# Altium schematic sheet BoardA.SchDoc
size C; SheetNumber: 1; SheetTotal: 2; SPICEModelCacheRKNZGAWU: <root> / <DocumentId>RKNZGAWU</DocumentId> / <CacheFrame Number="0"> / <Model Name="umk107bj105_a-t" Kind="CKT"> / <Text>* UMK107BJ105_A-T     SPICE MODEL  ( General Type ) / *-------------------------------------------------------------------------------------------------------- / * Model Generated by TAIYO YUDEN Corporation (http://www.ty-top.com) / * Version 1.0 / * TAIYO YUDEN Control No. 170508_130520 / * Copyright(c) 2012 TAIYO YUDEN CO.,LTD. All Rights Reserved. / *-------------------------------------------------------------------------------------------------------- / * / * Products Name : Multilayer Ceramic Capacitors / * / * Characteristics : / *     Capacitance : 1 uF , Rated Voltage : 50V , TCC : X5R / *     Case Size : 1.6 x 0.8 / 0.063 x 0.031 [mm/inch] , Thickness : 0.8 / 0.031 [mm/inch] / *     (Conditions: Temperature = 25 degC , DC Bias Current/Voltage = 0A / 0V) / * / * Frequency Range : 40Hz - 3GHz / * / * External Node Assignments : / * / *  1  o---| |---o  2 / * / *-------------------------------------------------------------------------------------------------------- / .SubCkt UMK107BJ105_A-T 1 2 / **************************** / C0 1 110 0.79929u / Cm 1 101 0.13681u / C1 101 102 0.26224u / Rc1 101 102 5.8806k / C2 102 103 0.057839u / Rc2 102 103 469.42 / C3 103 110 0.014568u / Rc3 103 110 14.853 / C2m 1 301 0.13283u / C21 301 302 1.2593u / Rc21 301 302 6.3079k / C22 302 303 1.1189u / Rc22 302 303 6.9405k / C23 303 304 1.1421u / Rc23 303 304 6.4848k / C24 304 305 0.36861u / Rc24 304 305 785 / C25 305 306 0.39327u / Rc25 305 306 637.41 / C26 306 307 0.27451u / Rc26 306 307 19.365 / C27 307 308 0.15295u / Rc27 307 308 23.239 / C28 308 309 0.17569u / Rc28 308 309 17.788 / C29 309 110 1420.6p / Rc29 309 110 1.9725 / Rp0 1 110 500Meg / L0 110 120 0.24088n / Lm 120 130 0.1369n / L1 120 121 0.1842n / RL1 121 130 0.29804 / L2 120 122 0.40657n / RL2 122 130 0.57395 / L3 120 123 0.85773n / RL3 123 130 0.82282 / CR 120 124 0.11463u / LR 124 125 0.25983n / RR 125 130 52.447m / CL 130 140 1.4637p / LL 130 140 0.23986n / RL 130 140 33.985 / Rs 140 2 6.8539m / **************************** / .ends UMK107BJ105_A-T</Text> / </Model> / </CacheFrame> / </root>
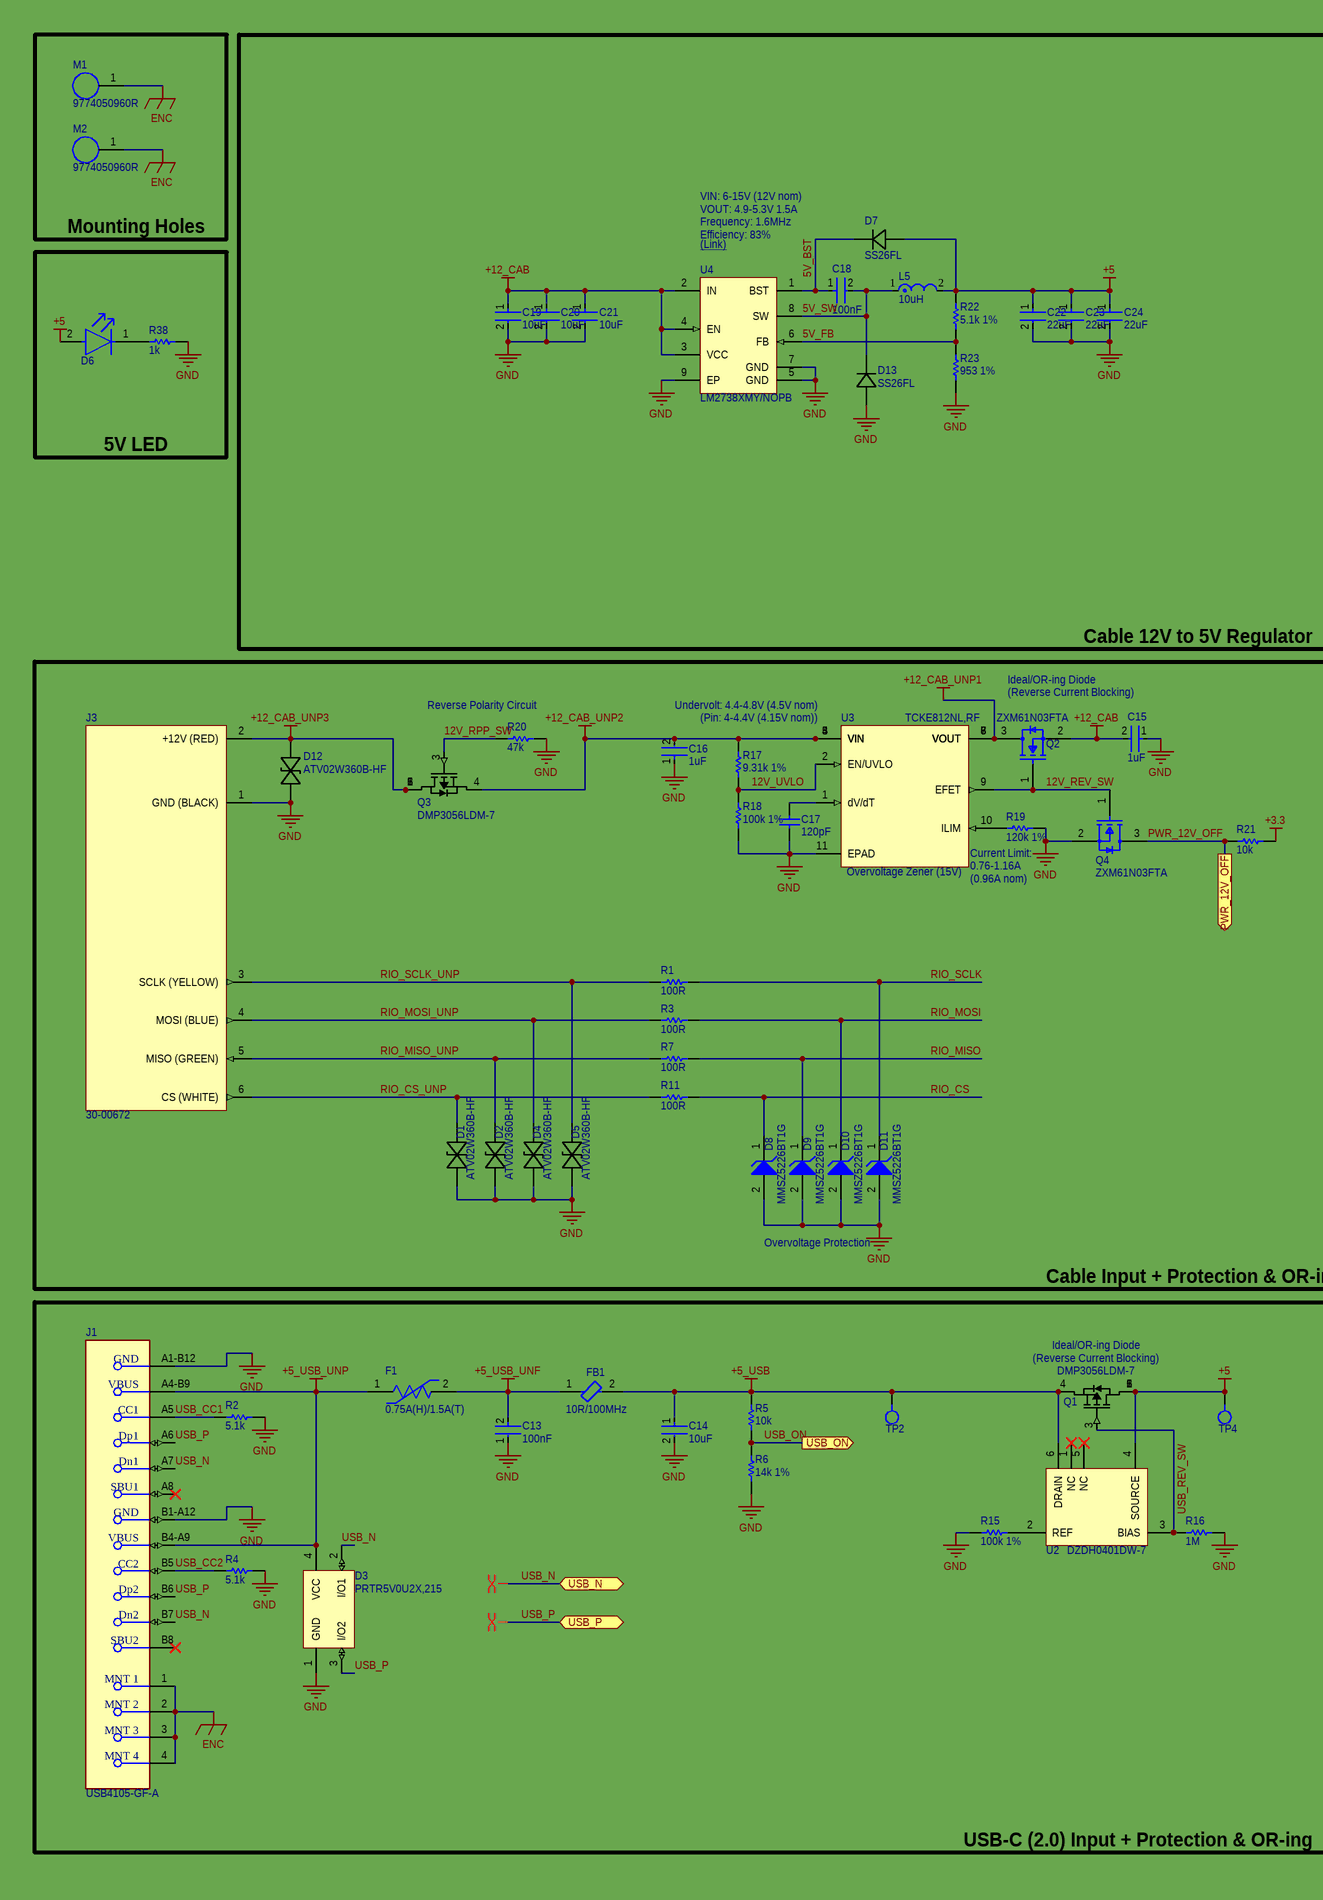
[diagram p0: BoardA.SchDoc, left]
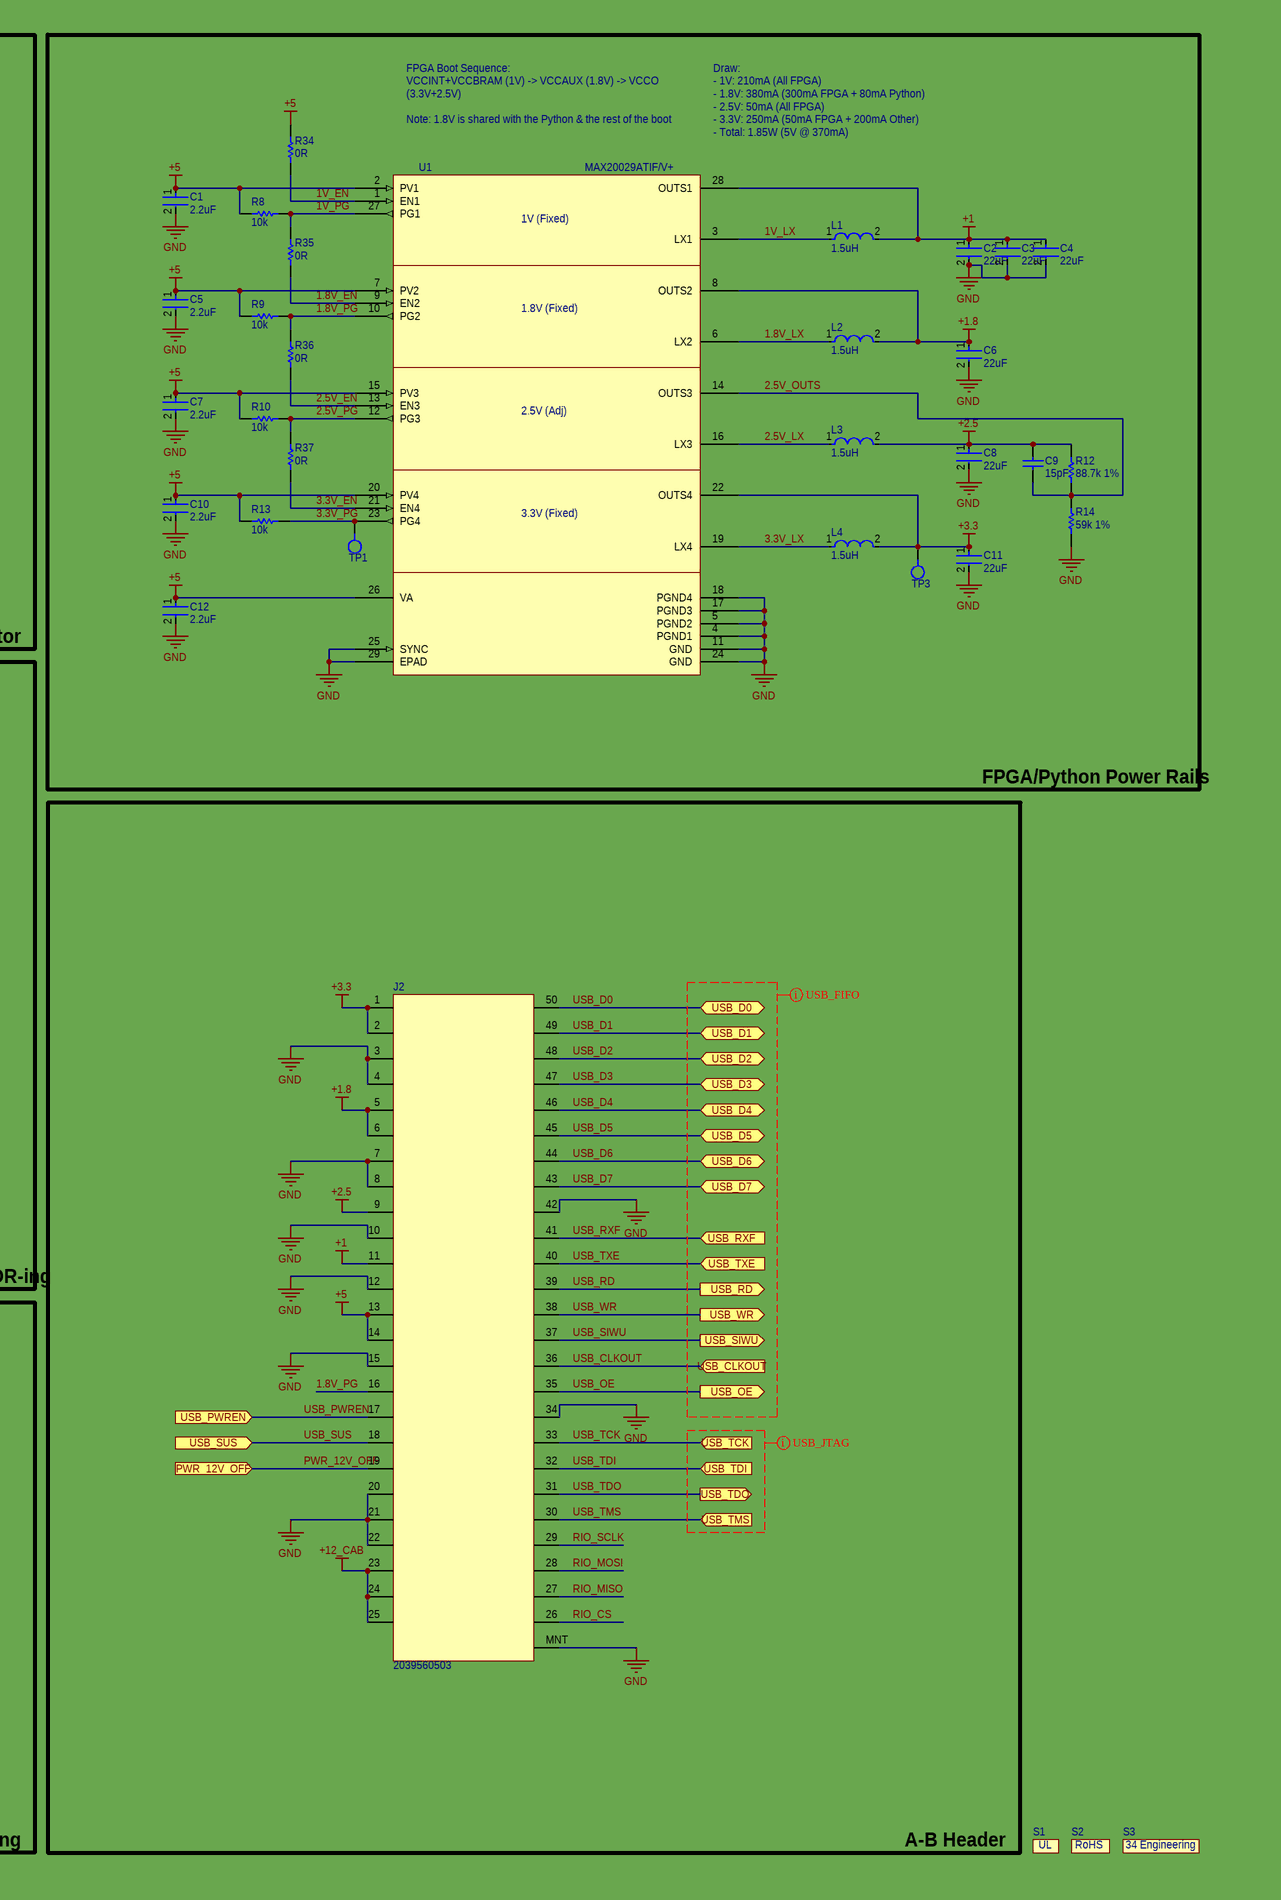
[diagram p1: BoardA.SchDoc, right]

## Parts
C1  2.2uF  [FP-C1005-050-0_15-0_1-MFG]
C2  22uF  [FP-GRM21B-0_15-MFG]
C3  22uF  [FP-GRM21B-0_15-MFG]
C4  22uF  [FP-GRM21B-0_15-MFG]
C5  2.2uF  [FP-C1005-050-0_15-0_1-MFG]
C6  22uF  [FP-GRM21B-0_15-MFG]
C7  2.2uF  [FP-C1005-050-0_15-0_1-MFG]
C8  22uF  [FP-GRM21B-0_15-MFG]
C9  15pF  [CAPC1005X55X25NL05T10]
C10  2.2uF  [FP-C1005-050-0_15-0_1-MFG]
C11  22uF  [FP-GRM21B-0_15-MFG]
C12  2.2uF  [FP-C1005-050-0_15-0_1-MFG]
C13  100nF  [FP-GRM15-IPC_C]
C14  10uF  [FP-CL05A106MP5NUNC-IPC_B]
C15  1uF  [FP-0603-L_1_6_0_1-W_0_8_0-IPC_B]
C16  1uF  [FP-0603-L_1_6_0_1-W_0_8_0-IPC_B]
C17  120pF  [CAPC1005X55X25ML05T10]
C18  100nF  [FP-CGA3E-0_3-0_1-IPC_C]
C19  10uF  [FP-GRM188-0_2-MFG]
C20  10uF  [FP-GRM188-0_2-MFG]
C21  10uF  [FP-GRM188-0_2-MFG]
C22  22uF  [FP-GRM21B-0_15-MFG]
C23  22uF  [FP-GRM21B-0_15-MFG]
C24  22uF  [FP-GRM21B-0_15-MFG]
D1  ATV02W360B-HF  [ATV02W]
D2  ATV02W360B-HF  [ATV02W]
D3  PRTR5V0U2X,215  [NXP-SOT143B-4_V]
D4  ATV02W360B-HF  [ATV02W]
D5  ATV02W360B-HF  [ATV02W]
D6  SML-D12U1WT86  [FP-SML-D12-MFG]  (value not drawn)
D7  SS26FL  [SS26FL]
D8  MMSZ5226BT1G  [ONSC-SOD-123-2-425-04_V]
D9  MMSZ5226BT1G  [ONSC-SOD-123-2-425-04_V]
D10  MMSZ5226BT1G  [ONSC-SOD-123-2-425-04_V]
D11  MMSZ5226BT1G  [ONSC-SOD-123-2-425-04_V]
D12  ATV02W360B-HF  [ATV02W]
D13  SS26FL  [SS26FL]
F1  0.75A(H)/1.5A(T)  [FP-0ZCK0075FF2E-MFG]
FB1  10R/100MHz  [FP-BLM15-0_05-IPC_A]
J1  USB4105-GF-A  [FP-USB4105-GF-A-MFG]
J2  2039560503  [2039560503]
J3  30-00672  [30-00672]
L1  1.5uH  [FP-DFE252012C-IPC_C]
L2  1.5uH  [FP-DFE252012C-IPC_C]
L3  1.5uH  [FP-DFE252012C-IPC_C]
L4  1.5uH  [FP-DFE252012C-IPC_C]
L5  10uH  [FP-VLS6045EX-100M-MFG]
M1  9774050960R  [9774050960R]
M2  9774050960R  [9774050960R]
Q1  DMP3056LDM-7  [SOT95P285X130-6N]
Q2  ZXM61N03FTA  [FP-SOT23-MFG]
Q3  DMP3056LDM-7  [SOT95P285X130-6N]
Q4  ZXM61N03FTA  [FP-SOT23-MFG]
R1  100R  [RESC2013X60X35ML10T20]
R2  5.1k  [RESC1005X40X25LL10T10]
R3  100R  [RESC2013X60X35ML10T20]
R4  5.1k  [RESC1005X40X25LL10T10]
R5  10k  [RESC1005X40X25LL05T05]
R6  14k 1%  [RESC1005X40X25ML05T05]
R7  100R  [RESC2013X60X35ML10T20]
R8  10k  [RESC1005X40X25LL05T05]
R9  10k  [RESC1005X40X25LL05T05]
R10  10k  [RESC1005X40X25LL05T05]
R11  100R  [RESC2013X60X35ML10T20]
R12  88.7k 1%  [RESC1005X40X25NL05T05]
R13  10k  [RESC1005X40X25LL05T05]
R14  59k 1%  [RESC1005X40X25LL05T05]
R15  100k 1%  [RESC1005X40X25NL05T10]
R16  1M  [RESC1005X40X25LL05T05]
R17  9.31k 1%  [RESC1005X40X25NL05T05]
R18  100k 1%  [RESC1005X40X25NL05T10]
R19  120k 1%  [RESC1005X40X25NL05T05]
R20  47k  [RESC1608X55X30NL15T15]
R21  10k  [RESC1005X40X25LL05T05]
R22  5.1k 1%  [RESC1608X55X30NL15T15]
R23  953 1%  [RESC1608X55X30NL15T15]
R34  0R  [RESC1005X40X25NL05T10]
R35  0R  [RESC1005X40X25NL05T10]
R36  0R  [RESC1005X40X25NL05T10]
R37  0R  [RESC1005X40X25NL05T10]
R38  1k  [RESC1005X40X25NL05T05]
S1  (no value)  [UL]
S2  (no value)  [RoHS]
S3  (no value)  [34EngineeringLogo]
TP1  (no value)  [TestPoint1mm]
TP2  (no value)  [TestPoint1mm]
TP3  (no value)  [TestPoint1mm]
TP4  (no value)  [TestPoint1mm]
U1  MAX20029ATIF/V+  [MAX20029ATIF/V+]
U2  DZDH0401DW-7  [DZDH0401DW-7]
U3  TCKE812NL,RF  [WSON10B_TOS]
U4  LM2738XMY/NOPB  [DGN0008A_N]

## Blocks framed on the sheet
Mounting Holes: M1 M2
Cable 12V to 5V Regulator: C18-C24 D7 D13 L5 R22 R23 U4
FPGA/Python Power Rails: C1-C12 L1-L4 R8-R10 R12-R14 R34-R37 TP1 TP3 U1
5V LED: D6 R38
Cable Input + Protection & OR-ing: C15-C17 D1 D2 D4 D5 D8-D12 J3 Q2-Q4 R1 R3 R7 R11 R17-R21 U3
A-B Header: J2

## Ports
PWR_12V_OFF (in), PWR_12V_OFF (out), USB_CLKOUT (in), USB_D0 (bidir), USB_D1 (bidir), USB_D2 (bidir), USB_D3 (bidir), USB_D4 (bidir), USB_D5 (bidir), USB_D6 (bidir), USB_D7 (bidir), USB_N (bidir), USB_OE (out), USB_ON (out), USB_P (bidir), USB_PWREN (in), USB_RD (out), USB_RXF (in), USB_SIWU (out), USB_SUS (in), USB_TCK (in), USB_TDI (in), USB_TDO (out), USB_TMS (in), USB_TXE (in), USB_WR (out)

## Nets
+1: C2.1 C3.1 C4.1 J2.11 L1.2 U1.28(OUTS1)
+1.8: C6.1 J2.5 J2.6 L2.2 U1.8(OUTS2)
+2.5: C8.1 C9.2 J2.9 L3.2 R12.2
+3.3: C11.1 J2.1 J2.2 L4.2 R21.2 TP3.1 U1.22(OUTS4)
+5: C1.1 C5.1 C7.1 C10.1 C12.1 C22.1 C23.1 C24.1 D6.2(A) D7.2 J2.13 J2.14 L5.2 Q1.1 Q1.2 Q1.5 Q1.6 R8.1 R9.1 R10.1 R13.1 R22.2 R34.2 TP4.1 U1.2(PV1) U1.7(PV2) U1.15(PV3) U1.20(PV4) U1.26(VA) U2.4(SOURCE)
+5_USB: C14.1 FB1.2 Q1.4 R5.2 TP2.1 U2.6(DRAIN)
+5_USB_UNF: C13.2 F1.2 FB1.1
+5_USB_UNP: D3.4(VCC) F1.1 J1.A4-B9(VBUS) J1.B4-A9(VBUS)
+12_CAB: C15.2 C19.1 C20.1 C21.1 J2.23 J2.24 J2.25 Q2.2(S) U4.2(IN) U4.3(VCC) U4.4(EN)
+12_CAB_UNP1: Q2.3(D) U3.6(VOUT) U3.7(VOUT) U3.8(VOUT)
+12_CAB_UNP2: C16.2 Q3.4 R17.2 U3.3(VIN) U3.4(VIN) U3.5(VIN)
+12_CAB_UNP3: D12.2 J3.2(+12V_(RED)) Q3.1 Q3.2 Q3.5 Q3.6
ENC: J1.1(MNT_1) J1.2(MNT_2) J1.3(MNT_3) J1.4(MNT_4) M1.1 M2.1
GND: C1.2 C2.2 C3.2 C4.2 C5.2 C6.2 C7.2 C8.2 C10.2 C11.2 C12.2 C13.1 C14.2 C15.1 C16.1 C17.1 C19.2 C20.2 C21.2 C22.2 C23.2 C24.2 D1.2 D2.2 D3.1(GND) D4.2 D5.2 D8.2(A) D9.2(A) D10.2(A) D11.2(A) D12.1 D13.2 J1.A1-B12(GND) J1.B1-A12(GND) J2.3 J2.4 J2.7 J2.8 J2.10 J2.12 J2.15 J2.20 J2.21 J2.22 J2.34 J2.42 J2.MNT J3.1(GND_(BLACK)) Q4.2(S) R2.2 R4.2 R6.1 R14.1 R15.2 R16.2 R18.1 R19.2 R20.1 R23.1 R38.2 U1.4(PGND1) U1.5(PGND2) U1.11(GND) U1.17(PGND3) U1.18(PGND4) U1.24(GND) U1.25(SYNC) U1.29(EPAD) U3.11(EPAD) U4.5(GND) U4.7(GND) U4.9(EP)
1.8V_EN: R35.1 U1.9(EN2)
1.8V_LX: L2.1 U1.6(LX2)
1.8V_PG: J2.16 R9.2 R36.2 U1.10(PG2)
1V_EN: R34.1 U1.1(EN1)
1V_LX: L1.1 U1.3(LX1)
1V_PG: R8.2 R35.2 U1.27(PG1)
2.5V_EN: R36.1 U1.13(EN3)
2.5V_LX: L3.1 U1.16(LX3)
2.5V_OUTS: C9.1 R12.1 R14.2 U1.14(OUTS3)
2.5V_PG: R10.2 R37.2 U1.12(PG3)
3.3V_EN: R37.1 U1.21(EN4)
3.3V_LX: L4.1 U1.19(LX4)
3.3V_PG: R13.2 TP1.1 U1.23(PG4)
5V_BST: C18.1 D7.1 U4.1(BST)
5V_FB: R22.1 R23.2 U4.6(FB)
5V_SW: C18.2 D13.1 L5.1 U4.8(SW)
12V_REV_SW: Q2.1(G) Q4.1(G) U3.9(EFET)
12V_RPP_SW: Q3.3 R20.2
12V_UVLO: R17.1 R18.2 U3.2(EN/UVLO)
PWR_12V_OFF: J2.19 Q4.3(D) R21.1 ; port PWR_12V_OFF
RIO_CS: D8.1(K) J2.26 R11.2
RIO_CS_UNP: D1.1 J3.6(CS_(WHITE)) R11.1
RIO_MISO: D9.1(K) J2.27 R7.2
RIO_MISO_UNP: D2.1 J3.5(MISO_(GREEN)) R7.1
RIO_MOSI: D10.1(K) J2.28 R3.2
RIO_MOSI_UNP: D4.1 J3.4(MOSI_(BLUE)) R3.1
RIO_SCLK: D11.1(K) J2.29 R1.2
RIO_SCLK_UNP: D5.1 J3.3(SCLK_(YELLOW)) R1.1
USB_CC1: J1.A5(CC1) R2.1
USB_CC2: J1.B5(CC2) R4.1
USB_CLKOUT: J2.36 ; port USB_CLKOUT
USB_D0: J2.50 ; port USB_D0
USB_D1: J2.49 ; port USB_D1
USB_D2: J2.48 ; port USB_D2
USB_D3: J2.47 ; port USB_D3
USB_D4: J2.46 ; port USB_D4
USB_D5: J2.45 ; port USB_D5
USB_D6: J2.44 ; port USB_D6
USB_D7: J2.43 ; port USB_D7
USB_N: D3.2(I/O1) J1.A7(Dn1) J1.B7(Dn2) ; port USB_N
USB_OE: J2.35 ; port USB_OE
USB_ON: R5.1 R6.2 ; port USB_ON
USB_P: D3.3(I/O2) J1.A6(Dp1) J1.B6(Dp2) ; port USB_P
USB_PWREN: J2.17 ; port USB_PWREN
USB_RD: J2.39 ; port USB_RD
USB_REV_SW: Q1.3 R16.1 U2.3(BIAS)
USB_RXF: J2.41 ; port USB_RXF
USB_SIWU: J2.37 ; port USB_SIWU
USB_SUS: J2.18 ; port USB_SUS
USB_TCK: J2.33 ; port USB_TCK
USB_TDI: J2.32 ; port USB_TDI
USB_TDO: J2.31 ; port USB_TDO
USB_TMS: J2.30 ; port USB_TMS
USB_TXE: J2.40 ; port USB_TXE
USB_WR: J2.38 ; port USB_WR
NetC17_2: C17.2 U3.1(dV/dT)
NetD6_1: D6.1(C) R38.1
NetR15_1: R15.1 U2.2(REF)
NetR19_1: R19.1 U3.10(ILIM)

Not connected (* = marked no-connect by the designer): J1 A8(SBU1)* B8(SBU2)*; U2 1(NC)* 5(NC)*

## Layout directives
differential pair; differential pair class USB: USB_N, USB_P
mark named USB_JTAG: (no net found under the mark)
mark named USB_FIFO: (no net found under the mark)

## Notes on the sheet
- FPGA Boot Sequence:
  VCCINT+VCCBRAM (1V) -> VCCAUX (1.8V) -> VCCO (3.3V+2.5V)
  Note: 1.8V is shared with the Python & the rest of the boot sequence is on PCB B
- Draw:
  - 1V: 210mA (All FPGA)
  - 1.8V: 380mA (300mA FPGA + 80mA Python)
  - 2.5V: 50mA (All FPGA)
  - 3.3V: 250mA (50mA FPGA + 200mA Other)
  - Total: 1.85W (5V @ 370mA)
- VIN: 6-15V (12V nom)
  VOUT: 4.9-5.3V 1.5A
  Frequency: 1.6MHz
  Efficiency: 83%
- (near U4) (Link) <https://webench.ti.com/power-designer/switching-regulator/customize/40?noparams=0>
- (near U1) 1V (Fixed)
- (near U1) 1.8V (Fixed)
- (near U1) 2.5V (Adj)
- (near U1) 3.3V (Fixed)
- (near R20) Reverse Polarity Circuit
- Undervolt: 4.4-4.8V (4.5V nom)
- (Reverse Current Blocking)
- Ideal/OR-ing Diode
- (near U3) (Pin: 4-4.4V (4.15V nom))
- (near U3) Overvoltage Zener (15V)
- (near U3) Current Limit:
  0.76-1.16A
  (0.96A nom)
- Overvoltage Protection
- (near Q1) Ideal/OR-ing Diode
- (near Q1) (Reverse Current Blocking)
- USB-C (2.0) Input + Protection & OR-ing
- (in symbol 34EngineeringLogo) 34 Engineering

## Library data of the parts
C1 C5 C7 C10 C12 = CMP-08246-004344-1: CAP CER 2.2UF 10V X7S 0402; Dielectric Material: Ceramic; Tolerance: 10%; Mount: Surface Mount; Height: 0.5mm; Package Quantity: 1; Depth: 0.5mm; RoHS Compliant: Yes; Length: 1mm; Thickness: 0.022inch; Packaging: Tape and Reel; Capacitance: 2.2uF; Case Code (Imperial): 0402; Resistor Type: Ceramic; Dielectric: X7S; Case/Package: 0402; Min Operating Temperature: -55°C; Voltage Rating: 10V; Series: C; Weight: 2.3E-05oz; Width: 0.02inch; Voltage Rating (DC): 10V; Case Code (Metric): 1005; Max Operating Temperature: 125°C; Termination: SMD/SMT; Lead Free: Lead Free
C2-C4 C6 C8 C11 C22-C24 = CMP-2007-03385-2: Chip Multilayer Ceramic Capacitors for General Purpose, 0805, 22uF, X5R, 15%, 20%, 6.3V; Material: Ceramic; Max Operating Temperature: 85°C; Voltage: 6.3V; Min Operating Temperature: -55°C; Case/Package: 0805; Thickness: 0.053inch; Dielectric: X5R; Packaging: Tape and Reel; Depth: 1.25mm; Termination: SMD/SMT; Voltage Rating (DC): 6.3V; Radiation Hardening: No; Tolerance: 20%; Mount: Surface Mount; Lead Free: Lead Free; Package Quantity: 1; REACH SVHC: No SVHC; Voltage Rating: 6.3V; Capacitance: 22uF; Length: 2mm; Case Code (Imperial): 0805; Case Code (Metric): 2012; Width: 0.049inch; Height: 1.25mm
C9 = CMP-2008-04267-1: Part Number: GRM1555C1H150JZ01D; Manufacturer: Murata
C13 = CMP-2100-03641-2: CAP CER 0.1UF 16V X7R 0402; Manufacturer Part Number: GRM155R71C104KA88D; Manufacturer: Murata; Standoff Height: 0mm; Tolerance: 10%; Voltage Rating: 16Vdc; Material: Ceramic; Capacitance: 0.10μF; Value: 0.10μF; RoHS: TRUE; Temperature Characteristic: X7R; Octopart: https://octopart.com/grm155r71c104ka88d-murata-196880; Digikey Description: CAP CER 0.1UF 16V X7R 0402; Device Class L3: Ceramic Capacitors; Height: 0.55mm; ComponentLink2Description: Datasheet; Temperature Range Low: -55°C; Ipc Land Pattern Name: CAPC10050X219; ComponentLink2URL: https://search.murata.co.jp/Ceramy/image/img/A01X/G101/ENG/GRM155R71H471KA01-01A.pdf; Device Class L1: Passive Components; Lead Free: yes; Category: Cap; Package: GRM15; Temperature: -55°C to +125°C; Device Class L2: Capacitors; Temperature Range High: +125°C; Mouser Description: 0402 0.1 uF 16V ±10 % Tolerance X7R SMT Multilayer Ceramic Capacitor
C14 = CMP-13271-000002-1: CAP CER 10UF 10V X5R 0402; Manufacturer Part Number: CL05A106MP5NUNC; Manufacturer: Samsung; Temperature Coefficient: 15%; Tolerance: 20%; Material: Ceramic; Octopart: https://octopart.com/cl05a106mp5nunc-samsung-22457395; Voltage Rating: 10V; RoHS: TRUE; Value: 10uF; Height: 0.7mm; Digikey Description: CAP CER 10UF 10V X5R 0402; Automotive: No; Package: CL05A106MP5NUNC; Device Class L1: Passive Components; Capacitance: 10uF; Temperature Range High: +85°C; ComponentLink2Description: Datasheet; Device Class L2: Capacitors; Temperature Characteristic: X5R; Temperature: -55°C to +85°C; ComponentLink2URL: http://www.samsungsem.com/kr/support/product-search/mlcc/__icsFiles/afieldfile/2019/05/10/19-CL05A106MP5NUNC.pdf; Device Class L3: Ceramic Capacitors; Category: Cap; Temperature Range Low: -55°C; Ipc Land Pattern Name: CAPC10050X50; Lead Free: Yes
C15 C16 = CMP-2000-05447-3: None; Tolerance: 10%; Voltage Rating: 50V; Dielectric: X5R; Height: 0.8mm; Depth: 0.8mm; Number of Pins: 2; Length: 1.6mm; Thickness: 0.035inch; Contact Plating: Nickel; Radiation Hardening: No; Package Quantity: 1; Case/Package: 0603; Capacitance: 1uF; Halogen Free: Halogen Free; RoHS Compliant: Yes; Termination: SMD/SMT; Max Operating Temperature: 85°C; Min Operating Temperature: -55°C; Case Code (Metric): 1608; Construction: Flat; Voltage Rating (DC): 50V; Packaging: Tape and Reel; Series: M; Case Code (Imperial): 0603; Width: 0.031inch; Mount: Surface Mount
C17 = CMP-2008-03922-1: Manufacturer: Murata; Part Number: GRM1555C1H121JA01D
C18 = CMP-2000-07546-2: Cap Ceramic 100nF 50V X7R 10% Pad SMD 0603 +125°C Automotive T/R; Weight: 7.1E-05oz; Composition: Ceramic; Max Operating Temperature: 125°C; Termination: SMD/SMT; Dielectric: X7R; Length: 1.6mm; Package Quantity: 1; REACH SVHC: No SVHC; Lead Free: Lead Free; Case Code (Metric): 1608; Min Operating Temperature: -55°C; Packaging: Tape and Reel; Tolerance: 10%; Voltage Rating: 50V; Case Code (Imperial): 0603; Capacitance: 100nF; Case/Package: 0603; Voltage Rating (DC): 50V; Depth: 0.8mm; Radiation Hardening: No; Ratings: AEC-Q200; Mount: Surface Mount; Voltage: 50V; Thickness: 0.035inch; Width: 0.8mm; Height: 0.8mm
C19-C21 = CMP-2006-02520-2: Chip Multilayer Ceramic Capacitors for General Purpose, 0603, 10uF, X5R, 15%, 20%, 25V; Tolerance: 20%; Resistor Type: Ceramic; Voltage: 25V; Max Operating Temperature: 85°C; Min Operating Temperature: -55°C; Capacitance: 10uF; Dielectric: X5R; Lead Free: Lead Free; REACH SVHC: No SVHC; Case/Package: 0603; Mount: Surface Mount; Voltage Rating (DC): 25V; Height: 0.8mm; Length: 1.6mm; Thickness: 0.031inch; Width: 0.031inch; Termination: SMD/SMT; Case Code (Imperial): 0603; Case Code (Metric): 1608; Package Quantity: 1; Packaging: Tape and Reel; Depth: 0.8mm; Voltage Rating: 25V; Weight: 0.000222oz; Number of Pins: 2
D1 D2 D4 D5 D12 = ATV02W360B-HF: No Description Available; Mfr_Name: Comchip; Type: DEV; Copyright: Copyright (C) 2022 Ultra Librarian. All rights reserved.; Manufacturer_Part_Number: ATV02W360B-HF; RefDes: RefDes
D3 = CMP-2000-05285-1: Ultra Low Capacitance Double Rail-to-Rail ESD Protection Diode, 5.5 V, 1 pF, -40 to 85 degC, 4-Pin SOT143B, RoHS, Tape and Reel; Manufacturer: NXP Semiconductors; Capacitance Value: 16pF; Number of Elements: 1; Rad Hardened: No; Reverse Breakdown Voltage: 6V; Working Voltage (Max): 5.5V; Polarity: Uni-Directional; Configuration: Quad; Leakage Current: 0.1uA; Product Height (mm): 1mm; Suppressor Type: DiodeArrays; Product Length (mm): 3mm; Product Depth (mm): 1.4mm; ESD Protection Voltage: 8KV@ContactDisc; Package Type: SOT; Mounting: SurfaceMount; Packaging: TapeandReel; Datasheet Version: Rev. 02, 01/2008; Reverse Stand-off Voltage: 5.5V; Manufacturer URL: http://www.nxp.com/; Operating Temp Range: -40Cto85C; Operating Temperature Classification: Industrial; Working Voltage: 5.5V; Operating Temperature Min Deg. C: -40C; Datasheet URL: https://datasheet.ciiva.com/4479/prtr5v0u2x-102853-4479461.pdf; Leakage Current (Max): 0.1uA; Direction Type: Uni-Directional; Pin Count: 3+Tab; Operating Temperature Max Deg. C: 85C; Mounting Style: SurfaceMount; Package / Case: SOT
D6 = CMP-08952-000009-1: LED RED DIFFUSED 1608 SMD; Manufacturer: Rohm; Led Orientation: Top View; Power Dissipation: 54mW; Forward Current: 20mA; Wavelength: 620nm; Reverse Voltage: 5V; Luminous Intensity: 63mcd; Forward Voltage: 2.2V; Mouser Description: SML-D12 Series Red 0603 Diffused 63 mcd 2.2 V Surface Mount LED; Temperature: -40°C to +85°C; Device Class L2: LEDs; Lead Free: Yes; Automotive: No; Octopart: https://octopart.com/sml-d12u1wt86-rohm-70850259; RoHS: TRUE; Colour: Red; Digikey Description: LED RED DIFFUSED 1608 SMD; Package: SML-D12; Device Class L1: Optoelectronics; Category: Diode; Temperature Range High: +85°C; Height: 0.65mm; ComponentLink2Description: Datasheet; Temperature Range Low: -40°C; ComponentLink2URL: https://www.rohm.com/datasheet/SML-D12U1W/sml-d12x1-e; Manufacturer Part Number: SML-D12U1WT86; Device Class L3: unset
D7 D13 = SS26FL: Diode Schottky Barrier Rectifier 60V 2A 2-Pin SOD-123F T/R; Manufacturer: ON Semiconductor / Fairchild; Reverse Recovery Time: 8.26ns; Element Configuration: Single; Max Forward Surge Current (Ifsm): 50A; Supplier 1: Arrow Electronics; Manufacturer Part Number: SS26FL; RoHS: Yes; Category: Rectifier Diodes; Stock 1: 288000; Pricing 1: 3000=0.09160, 6000=0.09070, 9000=0.07910, 12000=0.07830, 15000=0.07750, 24000=0.07030 (USD); Mount: Surface Mount; Case/Package: SOD; Weight: 0.0276g; Packaging: Tape and Reel; Average Rectified Current: 2A; Max Repetitive Reverse Voltage (Vrrm): 60V; Max Reverse Voltage (DC): 60V; RoHS Compliant: Yes; ComponentLink1URL: http://www.farnell.com/datasheets/2552652.pdf?src-supplier=Farnell; ComponentLink1Description: http://www.farnell.com/datasheets/2552652.pdf?src-supplier=Farnell; ComponentLink2URL: https://www.fairchildsemi.com/datasheets/SS/SS24FL.pdf?src-supplier=Digi-Key; ComponentLink2Description: https://www.fairchildsemi.com/datasheets/SS/SS24FL.pdf?src-supplier=Digi-Key; ComponentLink3URL: http://www.farnell.com/datasheets/2552652.pdf?src-supplier=Element14; ComponentLink3Description: http://www.farnell.com/datasheets/2552652.pdf?src-supplier=Element14; ComponentLink4URL: http://www.farnell.com/datasheets/2552652.pdf?src-supplier=Newark; ComponentLink4Description: http://www.farnell.com/datasheets/2552652.pdf?src-supplier=Newark; Supplier Part Number 1: SS26FL
D8-D11 = CMP-1060-00363-1: Zener Voltage Regulator, 500 mW, 2-Pin SOD-123, Pb-Free, Tape and Reel; Manufacturer: On Semiconductor; P Max (W): 0.5; VZ Typ (V): 3.3; PartNumber: MMSZ5226BT1G; ComponentLink1Description: Manufacturer URL; ComponentLink3URL: http://www.onsemi.com/pub_link/Collateral/425-04.PDF; ComponentLink3Description: Package Specification; ComponentLink2Description: Datasheet; ComponentLink1URL: http://www.onsemi.com/; Mounting Technology: Surface Mount; Packing: Tape and Reel; PackageDescription: 2-Pin SOD, Body 1.6 x 2.69 mm; ComponentLink2URL: http://www.onsemi.com/pub_link/Collateral/MMSZ5221BT1-D.PDF; RoHS: Pb-Free; PackageVersion: Rev. G, 10/2009; PackageReference: SOD-123-2-425-04; DatasheetVersion: Rev. 12
F1 = CMP-16043-000005-1: PTC RESET FUSE 6V 750MA 0805; Time to Trip: 0.2s; Trip Current: 1.5A; Max Current Rating: 40A; Hold Current: 750mA; Case Code (Metric): 2012; Packaging: Tape and Reel; Lead Free: Lead Free; Package Quantity: 1; Case Code (Imperial): 0805; Case/Package: 0805
FB1 = CMP-0686-00176-4: Chip Ferrite Bead, 0402, 10Ω @ 100MHz, 0.025Ω, 25%, 1A; Number of Circuits: 1; DC Resistance (DCR): 25mR; Shielding: Unshielded; Resistance: 50mR; Impedance: 10R; Max Current Rating: 1A; Length: 1mm; Min Operating Temperature: -55°C; Case Code (Imperial): 0402; Current Rating: 1A; Termination: SMD/SMT; Test Frequency: 100MHz; Depth: 0.55mm; Package Quantity: 1; Packaging: Tape and Reel; Height: 0.5mm; Max DC Current: 1A; DC Current: 1A; RoHS Compliant: Yes; Resistor Type: Ferrite Bead; Tolerance: 25%; Number of Lines: 1; Lead Free: Lead Free; Max Operating Temperature: 125°C; Core Material: Ferrite; Case Code (Metric): 1005; REACH SVHC: No SVHC; Width: 0.5mm; Radiation Hardening: No; Number of Pins: 2; Material: Ferrite; Case/Package: 0402; Military Standard: Not; Weight: 2.3E-05oz
J1 = CMP-245163-000001-1: CONN RCPT USB2.0 TYPEC 5A; Manufacturer: GCT; Voltage Rating: 20V; Is Female: yes; Current Rating: 5/6.25/1.25/0.25A; Number Of Contacts: 16; Conn Orientation: Right Angle; Device Class L1: Connectors; Category: Conn; Lead Free: Yes; RoHS: TRUE; Temperature Range High: +85°C; Digikey Description: CONN RCPT USB2.0 TYPEC 5A; Device Class L3: unset; ComponentLink2Description: Datasheet; Manufacturer Part Number: USB4105-GF-A; Package: 0; Usb Standard: USB 2.0; Device Class L2: USB Connectors; Automotive: No; Temperature Range Low: -40°C; Height: 3.46mm; Temperature: -40°C to +85°C; Contact Material: Gold,Nickel; ComponentLink2URL: https://gct.co/files/drawings/usb4105.pdf; Octopart: https://octopart.com/usb4105-gf-a-gct-106627878
J2 = 2039560503: SlimStack Board-to-Board Plug, 0.40mm Pitch, FSB5 Floating Series, 5.00mm Mated Height, 3.80 Mated Width, 50 Circuits; Manufacturer: Molex; Manufacturer Part Number: 203956-0503; Supplier 1: Mouser; RoHS: No; Stock 1: 5216; Pricing 1: 1=2.91000, 10=2.57000, 50=2.69000, 100=2.04000, 1000=1.78000, 2200=1.72000, 8800=1.68000, 10000=1.58000 (USD); Supplier Part Number 1: 538-203956-0503
J3 = 30-00672: Multi-Conductor Cable Braid Thermoplastic Elastomer 6Conductors 28AWG 4.9mm 300V Black; Manufacturer: Tensility; Conductor Material: Copper; Number of Conductors: 6; Supplier 1: Digi-Key; Manufacturer Part Number: 30-00672; RoHS: No; Stock 1: 6; Pricing 1: 1=23.49000, 5=19.22200, 10=14.95100 (USD); Color: Black; Insulation Material: Polyurethane; Min Operating Temperature: -40°C; Max Operating Temperature: 80°C; Voltage: 300V; Wire/Cable Type: Multi-Conductor; Wire/Cable Gauge: 28AWG; ComponentLink1URL: http://www.tensility.com/pdffiles/30-00672.pdf?src-supplier=Digi-Key; ComponentLink1Description: http://www.tensility.com/pdffiles/30-00672.pdf?src-supplier=Digi-Key; Supplier Part Number 1: T1388-5-ND
L1-L4 = CMP-06042-006881-1: Shielded Wirewound Inductor 1.5uH 20% 2600mA 0.06Ω 1008 (2520); Max DC Current: 2.6A; Current Rating: 3.5A; DC Resistance (DCR): 60mR; Core Material: Ferrite; Test Frequency: 1MHz; Height - Seated (Max): 0.039inch; Case Code (Metric): 2520; Max Operating Temperature: 125°C; Mount: Surface Mount; Shielding: Shielded; Length: 0.098inch; Depth: 2mm; Inductance: 1.5uH; Min Operating Temperature: -40°C; Tolerance: 20%; Case/Package: 1008; Case Code (Imperial): 1008; Width: 0.079inch; Resistor Type: Wirewound; Packaging: Tape and Reel
L5 = CMP-08253-000184-1: FIXED IND 10UH 3.4A 61 MOHM SMD; Saturation Current: 3.9A; Shielding: Shielded; Test Frequency: 100kHz; Core Material: Ferrite; Inductance Tolerance: 20%; DC Resistance (DCR): 61mR; Current Rating: 3.4A; REACH SVHC: No SVHC; Min Operating Temperature: -40°C; RoHS Compliant: Yes; Length: 0.236inch; Lead Free: Lead Free; Packaging: Cut Tape; RMS Current (Irms): 3.4A; Width: 0.236inch; Case/Package: Nonstandard; Resistor Type: Wirewound; Inductance: 10uH; Height - Seated (Max): 0.177inch; Mount: Surface Mount; Max Operating Temperature: 105°C; Tolerance: 20%
M1 M2 = 9774050960R: Spacer Material: Steel Mounting: SMT Series: WA-SMST For ø: 3.3 mm; Manufacturer: Wurth Electronics; Manufacturer Part Number: 9774070960R; Plating: Tin; Threaded/Unthreaded: Unthreaded; Inside Diameter: 0.13inch; Outside Diameter: 0.236inch; RoHS: Yes; Category: Spacers, Standoffs; Stock 1: 8947; Pricing 1: 1=1.73000, 10=1.65800, 50=1.45600, 100=1.35500 (USD); Material: Steel; Length: 0.33inch; REACH SVHC: Unknown; ComponentLink1URL: http://www.mouser.com/ds/2/445/9774070960R-611130.pdf?src-supplier=Mouser; ComponentLink1Description: http://www.mouser.com/ds/2/445/9774070960R-611130.pdf?src-supplier=Mouser; ComponentLink2URL: http://www.farnell.com/datasheets/1960400.pdf?src-supplier=Farnell; ComponentLink2Description: http://www.farnell.com/datasheets/1960400.pdf?src-supplier=Farnell; ComponentLink3URL: https://media.digikey.com/pdf/Data%20Sheets/Wurth%20Electronics%20PDFs/WA-SMSx_Performance_Flyer.pdf?src-supplier=Digi-Key; ComponentLink3Description: https://media.digikey.com/pdf/Data%20Sheets/Wurth%20Electronics%20PDFs/WA-SMSx_Performance_Flyer.pdf?src-supplier=Digi-Key; ComponentLink4URL: http://www.farnell.com/datasheets/1960400.pdf?src-supplier=Newark; ComponentLink4Description: http://www.farnell.com/datasheets/1960400.pdf?src-supplier=Newark; ComponentLink5URL: http://www.farnell.com/datasheets/1960400.pdf?src-supplier=Element14; ComponentLink5Description: http://www.farnell.com/datasheets/1960400.pdf?src-supplier=Element14; Stock 2: 1; Pricing 2: 650=0.83200, 1300=0.79000 (USD); ComponentLink6URL: http://www.mouser.com/ds/2/445/9774110960R-611133.pdf?src-supplier=Mouser; ComponentLink6Description: http://www.mouser.com/ds/2/445/9774110960R-611133.pdf?src-supplier=Mouser; ComponentLink7URL: http://www.farnell.com/datasheets/1960407.pdf?src-supplier=Farnell; ComponentLink7Description: http://www.farnell.com/datasheets/1960407.pdf?src-supplier=Farnell; ComponentLink8URL: http://www.farnell.com/datasheets/1960407.pdf?src-supplier=Element14; ComponentLink8Description: http://www.farnell.com/datasheets/1960407.pdf?src-supplier=Element14; Supplier 1: Digi-Key; Supplier 2: RSComponents; ComponentLink9URL: http://www.farnell.com/datasheets/1960396.pdf?src-supplier=Farnell; ComponentLink9Description: http://www.farnell.com/datasheets/1960396.pdf?src-supplier=Farnell; ComponentLink10URL: http://www.mouser.com/ds/2/445/9774050960R-611117.pdf?src-supplier=Mouser; ComponentLink10Description: http://www.mouser.com/ds/2/445/9774050960R-611117.pdf?src-supplier=Mouser; ComponentLink11URL: http://www.farnell.com/datasheets/1960396.pdf?src-supplier=Element14; ComponentLink11Description: http://www.farnell.com/datasheets/1960396.pdf?src-supplier=Element14; ComponentLink12URL: http://www.farnell.com/datasheets/1960396.pdf?src-supplier=Newark; ComponentLink12Description: http://www.farnell.com/datasheets/1960396.pdf?src-supplier=Newark; Supplier Part Number 2: 1768017
Q1 Q3 = DMP3056LDM-7: Trans Mosfet P-ch 30V 4.3A 6-PIN SOT-26 T/r / Mosfet P-ch 30V 4.3A SOT-26; Mfr_Name: Diodes Inc; Manufacturer_Part_Number: DMG4407SSS-13; Manufacturer: Diodes; Type: DEV; Rise Time: 6.6ns; Fall Time: 22.3ns; Turn-Off Delay Time: 50.1ns; Turn-On Delay Time: 10.2ns; Gate to Source Voltage (Vgs): 10V; Rds On Max: 45mR; Input Capacitance: 948pF; Number of Elements: 1; Max Power Dissipation: 1.5W; Drain to Source Breakdown Voltage: -30V; Element Configuration: Single; Polarity: P-CHANNEL; Copyright: Copyright (C) 2022 Ultra Librarian. All rights reserved.; RefDes: RefDes; Supplier 1: Arrow Electronics; Manufacturer Part Number: DMP3056LDM-7; RoHS: Yes; Category: MOSFETs; Stock 1: 366; Pricing 1: 1=0.31620, 10=0.31310, 25=0.30990, 100=0.23530, 250=0.23300, 500=0.20610, 1000=0.19360, 3000=0.17330 (USD); Mount: Surface Mount; Case/Package: SOT-26-6; Number of Pins: 6; Weight: 0.000529oz; Min Operating Temperature: -55°C; Max Operating Temperature: 150°C; Continuous Drain Current (ID): 4.3A; Package Quantity: 3000; Packaging: Cut Tape; Drain to Source Voltage (Vdss): 30V; Power Dissipation: 1.5W; Drain to Source Resistance: 45mR; Number of Channels: 1; Series: DMP3056; Length: 3mm; Width: 1.6mm; Height: 1.1mm; Radiation Hardening: No; REACH SVHC: No SVHC; Lead Free: Lead Free; RoHS Compliant: Yes; ComponentLink1URL: https://datasheet.ciiva.com/935/ds31449-935056.pdf?src-supplier=Digi-Key; ComponentLink1Description: https://datasheet.ciiva.com/935/ds31449-935056.pdf?src-supplier=Digi-Key; ComponentLink2URL: https://datasheet.ciiva.com/935/ds31449-935055.pdf?src-supplier=Digi-Key; ComponentLink2Description: https://datasheet.ciiva.com/935/ds31449-935055.pdf?src-supplier=Digi-Key; ComponentLink3URL: https://datasheet.ciiva.com/935/ds31449-935057.pdf?src-supplier=Digi-Key; ComponentLink3Description: https://datasheet.ciiva.com/935/ds31449-935057.pdf?src-supplier=Digi-Key; ComponentLink4URL: https://datasheet.ciiva.com/11176/ds31449-11176470.pdf?src-supplier=Avnet; ComponentLink4Description: https://datasheet.ciiva.com/11176/ds31449-11176470.pdf?src-supplier=Avnet; ComponentLink5URL: https://datasheet.ciiva.com/8115/ds31449-8115483.pdf?src-supplier=Avnet; ComponentLink5Description: https://datasheet.ciiva.com/8115/ds31449-8115483.pdf?src-supplier=Avnet; Supplier Part Number 1: DMP3056LDM-7
Q2 Q4 = CMP-12801-000012-1: MOSFET N-CH 30V 1.4A SOT23-3; Manufacturer: Diodes Inc.; Power Dissipation: 625mW; Reverse Recovery Time: 11ns; Standoff Height: 0.013mm; Number Of Channels: 1; Depletion Mode: False; Gate To Source Voltage: 20V; Turn On Delay Time: 1.9ns; Drain To Source Resistance: 0.22Ω; Max Forward Diode Voltage: 0.95V; Gate Charge At Vgs: 4.1nC @ 10V; Threshold Vgs Min: 1V; Pulse Drain Current: 7.3A; Max Junction Temp: +150°C; Turn Off Delay Time: 5.8ns; Reverse Recovery Charge: 3.5nC; Input Capacitace At Vds: 150pF @ 25V; Rthja Max: 200°C/W; ComponentLink2Description: Datasheet; Height: 1.1mm; Temperature Range Low: -55°C; Footprint Url: https://www.diodes.com/assets/Package-Files/SOT23.pdf; Device Class L2: Transistors; Drain To Source Voltage: 30V; ComponentLink2URL: https://www.diodes.com/assets/Datasheets/ZXM61N03F.pdf; Manufacturer Part Number: ZXM61N03FTA; Package: SOT23; Automotive: No; Temperature Range High: +150°C; Device Class L1: Discrete Semiconductors; Octopart: https://octopart.com/zxm61n03fta-diodes+inc.-660007; Lead Free: Yes; Mouser Description: MOSFET 30V N-Chnl HDMOS; Drain To Source Breakdown Voltage: 30V; Device Class L3: MOSFETs; Digikey Description: MOSFET N-CH 30V 1.4A SOT23-3; Continuous Drain Current: 1.4A; Number Of N Channels: 1; RoHS: TRUE; Temperature: -55°C to +150°C; Category: Trans
R1 R3 R7 R11 = CMP-2100-03669-1: Chip Resistor, 100 Ohm, +/-1%, 0.125 W, -55 to 155 degC, 0805 (2012 Metric), RoHS, Tape and Reel; Manufacturer: Yageo; Power Rating: 125mW; Resistance: 100Ohm; Voltage Rating: 150V; Tolerance: 1%; Temperature Coefficient: 100ppm/degreesC; Length: 2mm; Package Description: 2-Pin Surface Mounted Device, Body 2 x 1.25 mm; Case Code (Imperial): 0805; Number of Pins: 2; Termination: SMD/SMT; Lead Pitch: 0.4mm; Package Quantity: 1; Height: 0.024inch; Case Code (Metric): 2012; Number of Terminations: 2; Datasheet Version: Rev. 5, 10/2016; Lead Free: LeadFree; Package Reference: 0805; Composition: ThickFilm; REACH SVHC: Unknown; Voltage Rating (DC): 150V; Min Operating Temperature: -55degC; Packaging: TapeandReel; Military Standard: Not; Case/Package: 0805; Datasheet URL: http://www.yageo.com/NewPortal/yageodocoutput?fileName=/pdf/R-Chip/PYu-RC_Group_51_RoHS_L_5.pdf; Max Operating Temperature: 155degC; Manufacturer URL: http://www.yageo.com/; Max Power Dissipation: 125mW; Width: 0.049inch; Depth: 1.25mm; RoHSCompliant: true
R2 R4 = CMP-2002-05746-1: Manufacturer: TE Connectivity / AMP; Part Number: CRG0402F5K1
R5 R8-R10 R13 R21 = CMP-2000-07588-1: Chip Resistor, 10 KOhm, +/- 1%, 0.1 W, -55 to 155 degC, 0402 (1005 Metric), RoHS, Tape and Reel; Manufacturer: Panasonic; Power Rating: 100mW; Voltage Rating: 50V; Resistance: 10KOhm; Case\/Package: 0402; Temperature Coefficient: 100ppm\/degreesC; RoHSCompliant: True; Lead Free: LeadFree; Package Quantity: 1; Contact Plating: Tin; Length: 1mm; Radiation Hardening: No; REACH SVHC: NoSVHC; Max Operating Temperature: 155degC; Depth: 0.5mm; Case Code (Imperial): 0402; Military Standard: Not; Package Description: 2-Pin Surface Mount Device, Body 1 x 0.5 mm; Termination: SMD/SMT; Case Code (Metric): 1005; Height: 0.35mm; Packaging: TapeandReel; Voltage Rating (DC): 50V; Package Reference: 402; Number of Pins: 2; Tolerance: 1%; Mounting Technology: SurfaceMount; Width: 0.02inch; Mount: SurfaceMount; Datasheet URL: https://industrial.panasonic.com/cdbs/www-data/pdf/RDA0000/AOA0000C304.pdf; Composition: ThickFilm; Datasheet Version: 02/2017; Manufacturer URL: http://www.panasonic.com/; Max Power Dissipation: 100mW; Number of Terminations: 2; Min Operating Temperature: -55degC
R6 = CMP-2002-00679-1: Manufacturer: Panasonic; Part Number: ERJ-2RKF1402X
R12 = CMP-2002-00251-1: Manufacturer: Vishay Dale; Part Number: CRCW040288K7FKED
R14 = CMP-2002-00113-1: Part Number: CRCW040259K0FKED; Manufacturer: Vishay Dale
R15 R18 = CMP-2002-07343-1: Part Number: RC0402FR-07100KL; Manufacturer: Yageo / Phycomp
R16 = CMP-2002-00609-3: Chip Resistor, 1 MOhm, +/- 1%, 100 mW, -55 to 155 degC, 0402 (1005 Metric), RoHS, Tape and Reel; PartNumber: ERJ-2RKF1004X; Manufacturer: Basic Passives; Voltage Rating: 50 V; Case\/Package: 0402; Resistance: 1 MOhm; Power Rating: 100 mW; Pins: 2; Max Operating Temperature: 155 degC; ComponentLink2URL: http://industrial.panasonic.com/cdbs/www-data/pdf/RDA0000/AOA0000C86.pdf; Weight: 2.8E-05oz; ComponentLink1URL: http://www.panasonic.com/; Radiation Hardening: No; Height: 0.35 mm; Case Code (Imperial): 0402; ComponentLink2Description: Datasheet; Mount: Surface Mount; ComponentLink1Description: Manufacturer URL; REACH SVHC: Yes; Length: 1 mm; Min Operating Temperature: -55 degC; Width: 0.5 mm; Package Quantity: 10000; Tolerance: 1%; PackageDescription: 2-Pin Surface Mount Device, Body 1 x 0.5 mm; RoHSCompliant: true; DatasheetVersion: 04/2015; PackageReference: 0402; Mounting Technology: Surface Mount; Case Code (Metric): 1005; Packaging: Tape and Reel
R17 = CMP-1011-00620-2: Part Number: ERJ-2RKF9311X; Manufacturer: Panasonic
R19 = CMP-2002-01124-1: Part Number: ERJ2RKF1203X; Manufacturer: Panasonic
R20 = CMP-2000-00523-2: Chip Resistor, 47 KOhm, +/- 1%, 0.1 W, -55 to 155 degC, 0603 (1608 Metric), RoHS, Tape and Reel; Case\Package: 0603; Forward Current: 20 mA; Power Rating: 90 mW; Illumination Colour: Red; Nominal Vf: 2.1 V; Viewing Angle: 160 degrees; Luminous Intensity: 63 mcd; Lens Style: Clear; Nominal Wavelength: 639 nm; Case Code (Imperial): 0603; Case Code (Metric): 1608; Packaging: Tape and Reel; Radiation Hardening: No; Colour: Red; PackageDescription: 2-Pin Surface Mount Device, Body 1.6 x 0.85 mm; ComponentLink1Description: Manufacturer URL; Width: 0.8 mm; DatasheetVersion: Apr-15; ComponentLink2URL: http://industrial.panasonic.com/cdbs/www-data/pdf/RDA0000/AOA0000C86.pdf; Min Operating Temperature: -40 degC; Height: 0.6 mm; Package Quantity: 3000; ComponentLink2Description: Datasheet; REACH SVHC: No SVHC; ComponentLink1URL: http://www.panasonic.com/; Mount: Surface Mount; RoHSCompliant: true; Max Operating Temperature: 100 degC; PackageReference: 0603; Length: 1.6 mm; Forward Voltage: 2.1 V; Pins: 2
R22 = CMP-2000-00540-1: Part Number: ERJ-3EKF5101V; Manufacturer: Panasonic
R23 = CMP-1012-00508-2: Part Number: ERJ-3EKF9530V; Manufacturer: Panasonic
R34-R37 = CMP-1011-00001-2: Manufacturer: Yageo / Phycomp; Part Number: RC0402JR-070RL
R38 = CMP-1011-00510-4: Chip Resistor, 1 KOhm, +/- 1%, 100 mW, -55 to 155 degC, 0402 (1005 Metric), RoHS, Tape and Reel; PartNumber: ERJ-2RKF1001X; Manufacturer: Basic Passives; Voltage Rating: 50 V; Case\/Package: 0402; Resistance: 1 KOhm; Power Rating: 100 mW; DatasheetVersion: 04/2015; Radiation Hardening: No; Pins: 2; Height: 0.35 mm; RoHSCompliant: true; Case Code (Imperial): 0402; ComponentLink2Description: Datasheet; ComponentLink1Description: Manufacturer URL; PackageReference: 0402; Mount: Surface Mount; Package Quantity: 10000; Tolerance: 1%; ComponentLink1URL: http://www.panasonic.com/; PackageDescription: 2-Pin Surface Mount Device, Body 1 x 0.5 mm; Mounting Technology: Surface Mount; Case Code (Metric): 1005; ComponentLink2URL: http://industrial.panasonic.com/cdbs/www-data/pdf/RDA0000/AOA0000C86.pdf; REACH SVHC: Yes; Packaging: Tape and Reel; Max Operating Temperature: 155 degC; Min Operating Temperature: -55 degC; Width: 0.5 mm; Length: 1 mm
S1 = UL
S2 = RoHS
S3 = 34EngineeringLogo: 34 Engineering Silkscreen Logo
TP1-TP4 = TestPoint1mm: Test Point 1mm Diameter
U1 = MAX20029ATIF/V+: DC to DC Converter Quad Step-Down 3V to 5.5V Automotive 28-Pin TQFN Tube; Mfr_Name: Maxim Integrated Products; Manufacturer: Maxim; Copyright: Copyright (C) 2022 Ultra Librarian. All rights reserved.; Manufacturer_Part_Number: MAX20029ATIF/V+; RefDes: RefDes; Type: DEV; Supplier 1: Mouser; Manufacturer Part Number: MAX20029ATIF/V+; RoHS: Yes; Stock 1: 121; Pricing 1: 1=3.71000, 10=3.34000, 25=3.15000, 50=3.15000, 100=3.15000, 120=2.72000, 300=2.64000, 540=2.41000, 1000=2.41000, 1020=2.29000, 2520=2.25000, 10000=2.25000 (USD); Supplier Part Number 1: 700-MAX20029ATIF/V+
U2 = DZDH0401DW-7: Ideal Diode Controller 40V 300mA 300mW 6-Pin SOT-363 T/R; Mfr_Name: Diodes Inc; Manufacturer: Diodes; Copyright: Copyright (C) 2022 Ultra Librarian. All rights reserved.; Manufacturer_Part_Number: DZDH0401DW-7; RefDes: RefDes; Type: DEV; Supplier 1: Mouser; Manufacturer Part Number: DZDH0401DW-7; RoHS: Yes; Stock 1: 1625; Pricing 1: 1=0.43000, 10=0.32400, 50=0.32400, 100=0.17000, 500=0.13800, 1000=0.10600, 3000=0.09000, 10000=0.09000 (USD); Supplier Part Number 1: 621-DZDH0401DW-7
U3 = TCKE812NL,RF: 5.1V Voltage Clmp Latch Type; Manufacturer: Toshiba; Manufacturer Part Number: TCKE812NLRF; Supplier 1: Digi-Key; RoHS: Yes; Supplier Part Number 1: 655L16112I2T-ND
U4 = CMP-0069-01694-3: 550kHz/1.6MHz 1.5A Step-Down DC-DC Switching Regulator, 8-pin eMSOP, Pb-Free; Manufacturer: Texas Instruments; PowerWise: N; CompType: Switcher; PackageTopMarking: ZXTT*STDB; PackageDescription: Molded Mini-SO, Exposed Pad, .118 x .118 x .034in Body, 8 Lead, .0256in Pitch; RoHS: Y; ComponentLink1Description: Datasheet URL; ComponentLink1URL: http://www.ti.com/general/docs/lit/getliterature.tsp?genericPartNumber=LM2738&fileType=pdf; Code_JEDEC: MO-187-AA; PackageReference: DGN0008A; PinCount: 8